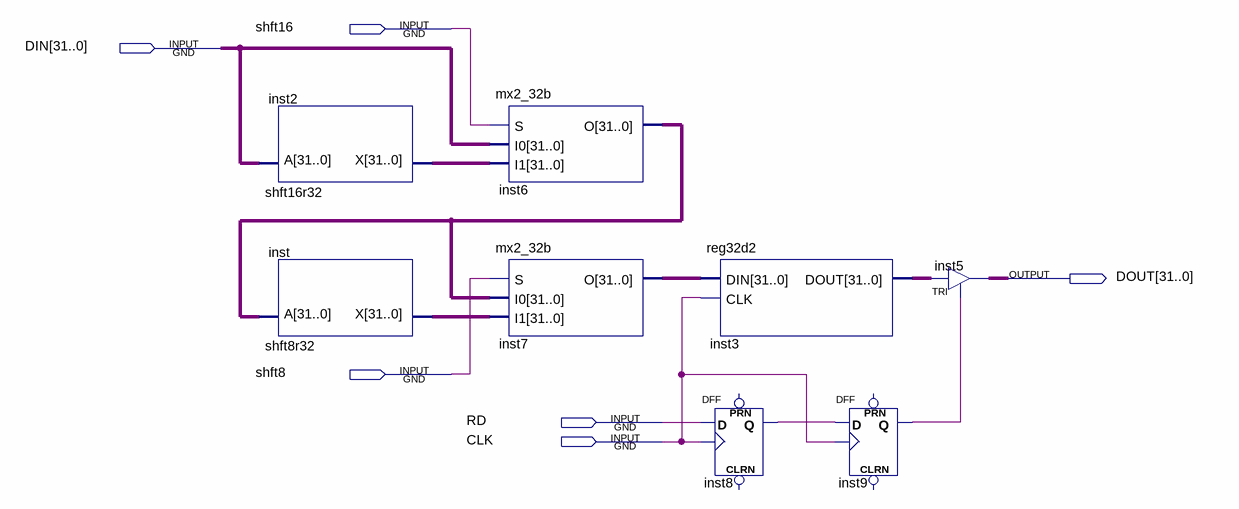
[diagram p0: schematic sheet]
// Quartus schematic sram_output_shift.bdf as structural Verilog: 8 symbols, 6 pins
module sram_output_shift (
  input  shft16,
  input  [31:0] DIN,
  input  shft8,
  input  RD,
  input  CLK,
  output [31:0] DOUT
);

  wire inst8_q, inst9_q;
  wire [31:0] inst2_x, inst3_dout, inst6_o, inst7_o, inst_x;

  shft16r32 inst2 (.A(DIN), .X(inst2_x));
  shft8r32 inst (.A(inst6_o), .X(inst_x));
  mx2_32b inst6 (.S(shft16), .I0(DIN), .I1(inst2_x), .O(inst6_o));
  mx2_32b inst7 (.S(shft8), .I0(inst6_o), .I1(inst_x), .O(inst7_o));
  reg32d2 inst3 (.DIN(inst7_o), .CLK(CLK), .DOUT(inst3_dout));
  DFF inst8 (.CLK(CLK), .D(RD), .Q(inst8_q));  // open: CLRN, PRN
  DFF inst9 (.CLK(CLK), .D(inst8_q), .Q(inst9_q));  // open: CLRN, PRN
  TRI inst5[31:0] (.IN(inst3_dout), .OE(inst9_q), .OUT(DOUT));
endmodule
